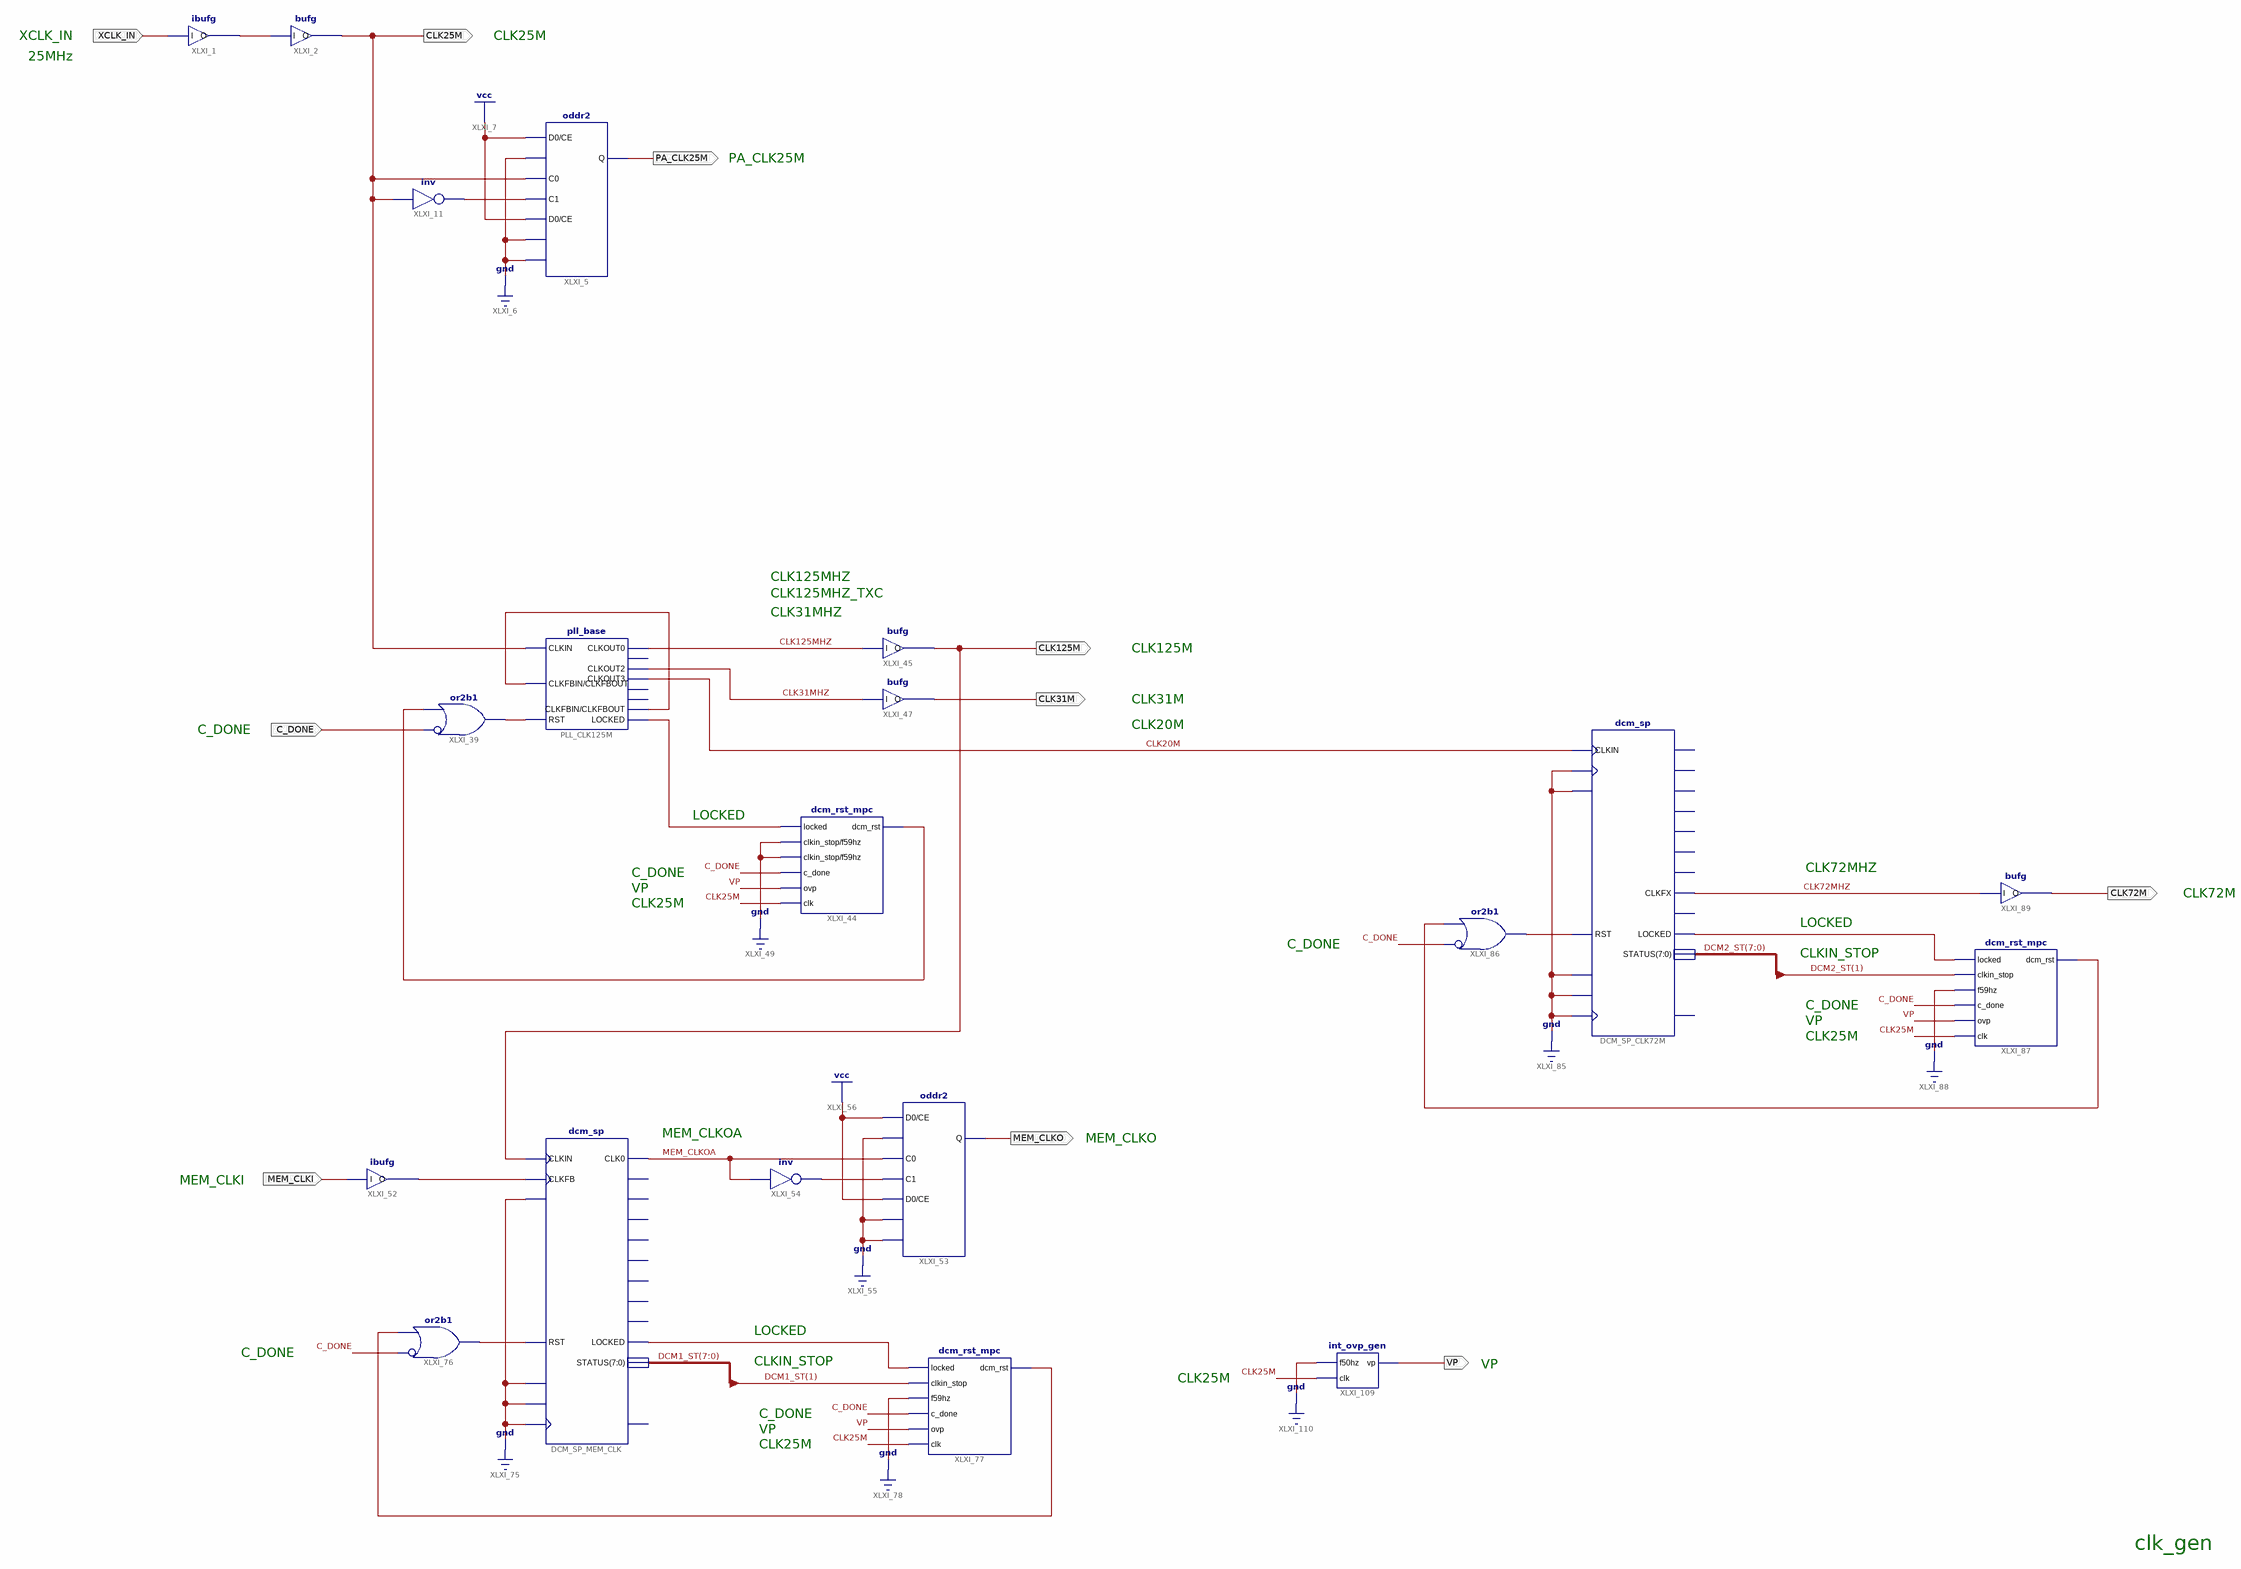
[diagram p0: schematic sheet 1]
// Xilinx ISE schematic clk_gen.sch (aspartan6) as structural Verilog: 20 symbols, 10 ports
module clk_gen (
  input  XCLK_IN,
  input  C_DONE,
  input  MEM_CLKI,
  output CLK25M,
  output PA_CLK25M,
  output VP,
  output CLK31M,
  output CLK125M,
  output MEM_CLKO,
  output CLK72M
);

  wire CLK20M, CLK31MHZ, CLK72MHZ, CLK125MHZ, MEM_CLKOA, XLXN_1, XLXN_14, XLXN_46, XLXN_47, XLXN_67, XLXN_74,
       XLXN_93, XLXN_98, XLXN_131, XLXN_139, XLXN_141, XLXN_151, XLXN_159, XLXN_161;
  wire [7:0] DCM1_ST, DCM2_ST;

  ibufg XLXI_1 (.I(XCLK_IN), .O(XLXN_1));
  bufg XLXI_2 (.I(XLXN_1), .O(CLK25M));
  oddr2 XLXI_5 (.D0(1'b1), .D1(1'b0), .C0(CLK25M), .C1(XLXN_14), .CE(1'b1), .R(1'b0), .Q(PA_CLK25M), .S(1'b0));
  not XLXI_11 (XLXN_14, CLK25M);
  or XLXI_39 (XLXN_46, ~C_DONE, XLXN_74);  // or2b1
  pll_base #(.REF_JITTER(0.01), .CLKOUT3_DIVIDE(25), .CLKOUT2_DIVIDE(16), .CLKOUT1_PHASE(90), .CLKOUT1_DIVIDE(4), .CLKOUT0_DIVIDE(4), .CLKIN_PERIOD(40), .CLKFBOUT_MULT(20)) PLL_CLK125M (
    .CLKIN(CLK25M), .CLKFBIN(XLXN_47), .RST(XLXN_46), .CLKOUT0(CLK125MHZ), .CLKOUT2(CLK31MHZ),
    .CLKOUT3(CLK20M), .CLKFBOUT(XLXN_47), .LOCKED(XLXN_67));  // open: CLKOUT1, CLKOUT4, CLKOUT5
  dcm_rst_mpc XLXI_44 (
    .locked(XLXN_67), .dcm_rst(XLXN_74), .clkin_stop(1'b0), .f59hz(1'b0), .c_done(C_DONE), .ovp(VP),
    .clk(CLK25M));
  oddr2 XLXI_53 (.D0(1'b1), .D1(1'b0), .C0(MEM_CLKOA), .C1(XLXN_98), .CE(1'b1), .R(1'b0), .Q(MEM_CLKO), .S(1'b0));
  not XLXI_54 (XLXN_98, MEM_CLKOA);
  dcm_sp #(.CLKIN_PERIOD(8)) DCM_SP_MEM_CLK (
    .CLKFB(XLXN_93), .CLKIN(CLK125M), .DSSEN(1'b0), .PSCLK(1'b0), .PSEN(1'b0), .PSINCDEC(1'b0),
    .RST(XLXN_131), .CLK0(MEM_CLKOA), .LOCKED(XLXN_139), .STATUS(DCM1_ST));  // open: CLK180, CLK270, CLK2X, CLK2X180, CLK90, CLKDV, CLKFX, CLKFX180, PSDONE
  ibufg XLXI_52 (.I(MEM_CLKI), .O(XLXN_93));
  or XLXI_76 (XLXN_131, ~C_DONE, XLXN_141);  // or2b1
  dcm_rst_mpc XLXI_77 (
    .locked(XLXN_139), .dcm_rst(XLXN_141), .clkin_stop(DCM1_ST[1]), .f59hz(1'b0), .c_done(C_DONE), .ovp(VP),
    .clk(CLK25M));
  dcm_sp #(.CLKIN_PERIOD(50), .CLK_FEEDBACK("NONE"), .CLKFX_MULTIPLY(18), .CLKFX_DIVIDE(5)) DCM_SP_CLK72M (
    .CLKFB(1'b0), .CLKIN(CLK20M), .DSSEN(1'b0), .PSCLK(1'b0), .PSEN(1'b0), .PSINCDEC(1'b0), .RST(XLXN_151),
    .CLKFX(CLK72MHZ), .LOCKED(XLXN_159), .STATUS(DCM2_ST));  // open: CLK0, CLK180, CLK270, CLK2X, CLK2X180, CLK90, CLKDV, CLKFX180, PSDONE
  or XLXI_86 (XLXN_151, ~C_DONE, XLXN_161);  // or2b1
  dcm_rst_mpc XLXI_87 (
    .locked(XLXN_159), .dcm_rst(XLXN_161), .clkin_stop(DCM2_ST[1]), .f59hz(1'b0), .c_done(C_DONE), .ovp(VP),
    .clk(CLK25M));
  bufg XLXI_89 (.I(CLK72MHZ), .O(CLK72M));
  int_ovp_gen XLXI_109 (.f50hz(1'b0), .clk(CLK25M), .vp(VP));
  bufg XLXI_45 (.I(CLK125MHZ), .O(CLK125M));
  bufg XLXI_47 (.I(CLK31MHZ), .O(CLK31M));

  // Notes on the sheet:
  //   XCLK_IN
  //   CLK25M
  //   25MHz
  //   PA_CLK25M
  //   CLK125MHZ
  //   CLK125MHZ_TXC
  //   CLK31MHZ
  //   CLK125M
  //   CLK31M
  //   CLK20M
  //   C_DONE
  //   LOCKED
  //   CLK72MHZ
  //   C_DONE
  //   VP
  //   CLK72M
  //   CLK25M
  //   LOCKED
  //   C_DONE
  //   CLKIN_STOP
  //   C_DONE
  //   VP
  //   CLK25M
  //   MEM_CLKOA
  //   MEM_CLKO
  //   MEM_CLKI
  //   LOCKED
  //   C_DONE
  //   CLKIN_STOP
  //   VP
  //   CLK25M
  //   C_DONE
  //   VP
  //   CLK25M
  //   clk_gen
endmodule
